# Altium schematic sheet Sensor Power Supply.SchDoc: Sensor Power Supply
size A4; Engineer: M.GUENI; Organization: Altium Limited; Address1: L3, 12a Rodborough Rd; Address2: Frenchs Forest; Address3: NSW; Address4: Australia 2086; Revision: R0; SheetNumber: 7; SheetTotal: 8
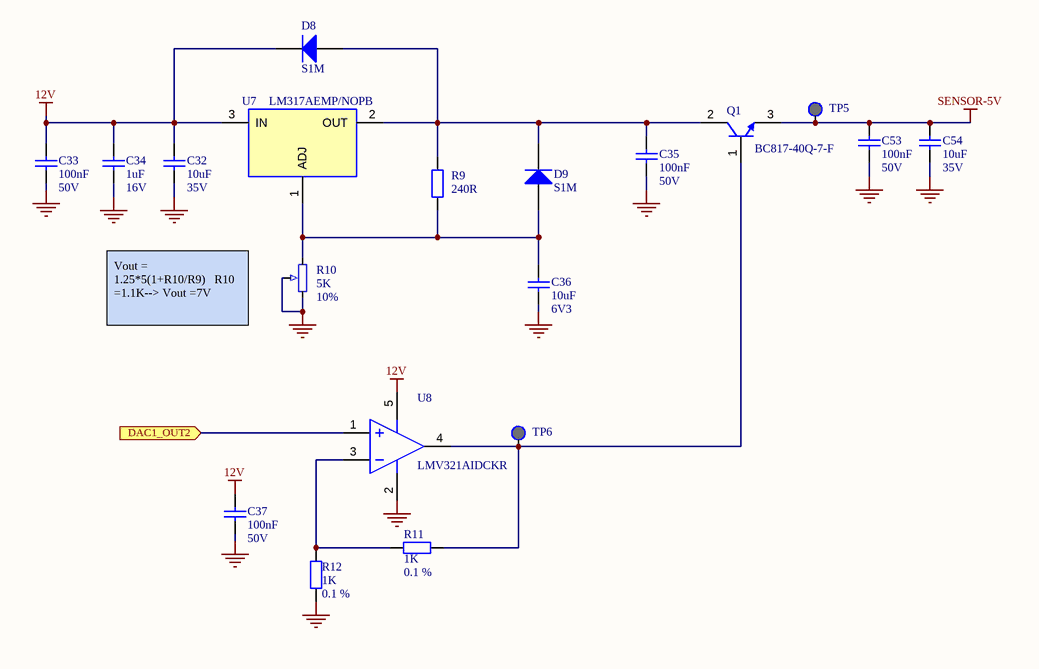
[diagram p0: Sensor Power Supply.SchDoc]

## Parts
C32  Value 1: 10uF  Value 2: 35V  [CAPC1608N]  (hidden comment: Capacitor)
C33  Value 1: 100nF  Value 2: 50V  [CAPC1608N]  (hidden comment: Capacitor)
C34  Value 1: 1uF  Value 2: 16V  [CAPC1608N]  (hidden comment: Capacitor)
C35  Value 1: 100nF  Value 2: 50V  [CAPC1608N]  (hidden comment: Capacitor)
C36  Value 1: 10uF  Value 2: 6V3  [CAPC2012N]  (hidden comment: Capacitor)
C37  Value 1: 100nF  Value 2: 50V  [CAPC1608N]  (hidden comment: Capacitor)
C53  Value 1: 100nF  Value 2: 50V  [CAPC1608N]  (hidden comment: Capacitor)
C54  Value 1: 10uF  Value 2: 35V  [CAPC1608N]  (hidden comment: Capacitor)
D8  S1M  [DIOM5227X270N]
D9  S1M  [DIOM5227X270N]
Q1  BC817-40Q-7-F  [SOT23-3N]
R9  Value 1: 240R  [RESC1608N]  (hidden comment: Resistor)
R10  Value 1: 5K  TOL: 10%  [3296W-1-502RLF]  (hidden comment: 3296W-1-502RLF)
R11  Value 1: 1K  TOL: 0.1 %  [RESC1608N]  (hidden comment: Resistor)
R12  Value 1: 1K  TOL: 0.1 %  [RESC1608N]  (hidden comment: Resistor)
TP5  Test Point  [TP]  (value not drawn)  (no BOM)
TP6  Test Point  [TP]  (value not drawn)  (no BOM)
U7  LM317AEMP/NOPB  [SOT-223-4]
U8  LMV321AIDCKR  [SC-70-5]

## Ports
DAC1_OUT2 (in)

## Nets
12V: C32.1 C33.1 C34.1 C37.1 D8.1(K) U7.3(IN) U8.5(+V)
GND: C32.2 C33.2 C34.2 C35.2 C36.2 C37.2 C53.2 C54.2 R10.2 R10.3 R12.2 U8.2(-V)
SENSOR-5V: C53.1 C54.1 Q1.3(E) TP5.1
DAC1_OUT2: U8.1(+IN) ; port DAC1_OUT2
NetC35_1: C35.1 D8.2(A) D9.1(K) Q1.2(C) R9.2 U7.2(OUT)
NetC36_1: C36.1 D9.2(A) R9.1 R10.1 U7.1(ADJ)
NetQ1_1: Q1.1(B) R11.1 TP6.1 U8.4(OUT)
NetR11_2: R11.2 R12.1 U8.3(-IN)

## Notes on the sheet
- (near R10) Vout = 1.25*5(1+R10/R9)   R10 =1.1K--> Vout =7V
- THIS DOCUMENT AND THE DATA DISCLOSED HEREIN OR
- HEREWITH IS THE PROPERTY OF ALTIUM LIMITED AND MAY
- DWG NO:
- REVISION
- REV:
- DESCRIPTION
- DATE
- APPROVED
- BE FREELY DISTRIBUTED IN WHOLE. NO RIGHTS ARE
- RESERVED OR EXPRESS OR IMPLIED WARANTEE GIVEN.
- ENG:
- APPROVALS
- PROJECT
- DSN:
- CHK:
- REFERENCE DOCUMENTS
- PROJECT REVISION:
- TITLE
- DOCUMENT REVISION:
- DESIGN ITEM:
- BOM:
- FAB DWG:
- PCB DWG:
- ASSY DWG:
- SCALE:
- A3
- SIZE
- CAGE CODE
- FILE NAME
- DWG NO.
- SHEET
- OF
- REV

## Library data of the parts
C32 C54 = CAP-000000006: MAN: Murata Electronics; MANREF: GRM188R6YA106MA73D; DES: Multilayer Ceramic Capacitors MLCC - SMD/SMT 0603 10uF 35volts *Derate Voltage/Temp; TOL: 20%; FTP: 0603; SUP: Mouser; SUPREF: 81-GRM188R6YA106MA3D; NOTE: _; Part Number: CAP-000000006
C33 C35 C37 C53 = CAP-000000002: MAN: VISHAY; MANREF: VJ0603V104ZXAPW1BC; DES: VJ0603V104ZXAPW1BC -  Condensateur céramique multicouche CMS, 0.1 µF, 50 V, 0603 [1608 Metric], +80%, -20%, Y5V; TOL: +80% -20%; FTP: 0603; SUP: Farnell; SUPREF: 2896408; NOTE: _; Part Number: CAP-000000002
C34 = CAP-000000011: MAN: MULTICOMP; MANREF: MC0603F105Z160CT; DES: MULTICOMP 	MC0603F105Z160CT  Condensateur céramique multicouche CMS, Série MC, 1 µF, +80%, -20%, Y5V, 16 V, 0603 [1608 Metric]; TOL: +80% -20%; FTP: 0603; SUP: Farnell; SUPREF: 1759408; NOTE: _; Part Number: CAP-000000011
C36 = CAP-000000001: MAN: MULTICOMP; MANREF: MCTT21X106M6R3CT; DES: MCTT21X106M6R3CT -  Condensateur céramique multicouche CMS, 10 µF, 6.3 V, 0805 [2012 Metric], ± 20%, X5R, Série MCTT; TOL: 20%; FTP: 0805; SUP: Farnell; SUPREF: 1759476; NOTE: _; Part Number: CAP-000000001
D8 D9 = DIR-000000001: MAN: ON Semiconductor / Fairchild; DES: Rectifiers 1.0A 1000V; Value 1: 1A; Value 2: 1000V; TOL: _; FTP: DO-214AC; SUP: Mouser; SUPREF: 512-S1M; Part Number: DIR-000000001; MANREF: S1M; NOTE: _
Q1 = TRP-000000008: MAN: Diodes Incorporated; DES: Bipolar Transistors - BJT SS Low Sat Transistor; Value 1: 0.5A; Value 2: 45V; TOL: _; FTP: SOT-23; SUP: Mouser; SUPREF: 621-BC817-40Q-7-F; Part Number: TRP-000000008; MANREF: BC817-40Q-7-F; NOTE: _
R9 = RES-000000110: MAN: MULTICOMP PRO; MANREF: MCWR06X2400FTL; DES: Résistance à puce CMS, Couche épaisse, 240 ohm, ± 1%, 100 mW, 0603 [1608 Metric], Couche épaisse; Value 2: 0.1W; TOL: 1%; FTP: 0603; SUP: Farnell; SUPREF: 2447305; NOTE: _; Part Number: RES-000000110
R10 = RES-000000111: MAN: Bourns; DES: Trimmer Resistors - Through Hole 3/8" 5Kohms Sealed Vertical Adjust; Value 2: 0.5W; FTP: THT; SUP: Mouser; SUPREF: 652-3296W-1-502RLF; NOTE: _; Part Number: RES-000000111; MANREF: 3296W-1-502RLF
R11 R12 = RES-000000112: MAN: TE Connectivity; MANREF: CPF0603B1K0E1; DES: Thin Film Resistors - SMD 1KOhm .063W 25PPM; Value 2: 0.625W; FTP: 0603; SUP: Mouser; SUPREF: 279-CPF0603B1K0E1; NOTE: _; Part Number: RES-000000112
TP5 TP6 = MIS-000000003: MAN: _; Part Number: MIS-000000003; MANREF: _; DES: _; Value 1: _; Value 2: _; TOL: _; FTP: _; SUP: _; SUPREF: _; NOTE: _
U7 = VRG-000000016: MAN: Texas Instruments; DES: Linear Voltage Regulators 3-TERMINAL ADJ REG; Value 1: 1.2 V to 37 V; Value 2: 1A; TOL: _; SUP: Mouser; SUPREF: 926-LM317AEMP/NOPB; Part Number: VRG-000000016; MANREF: LM317AEMP/NOPB; FTP: SOT-223-4; NOTE: _
U8 = OPA-000000001: MAN: Texas Instrument; DES: Operational Amplifiers - Op Amps Single Low-Voltage, Cost-Optimized Rail-to-Rail Output Operational Amplifier 5-SC70 -40 to 125; Value 1: _; SUP: Mouser; SUPREF: 595-LMV321AIDCKR; Part Number: OPA-000000001; MANREF: LMV321AIDCKR; Value 2: _; TOL: _; FTP: SC-70-5; NOTE: _